# Altium schematic sheet SOCPSBanks.SchDoc
size A3; SheetNumber: 14; SheetTotal: 18
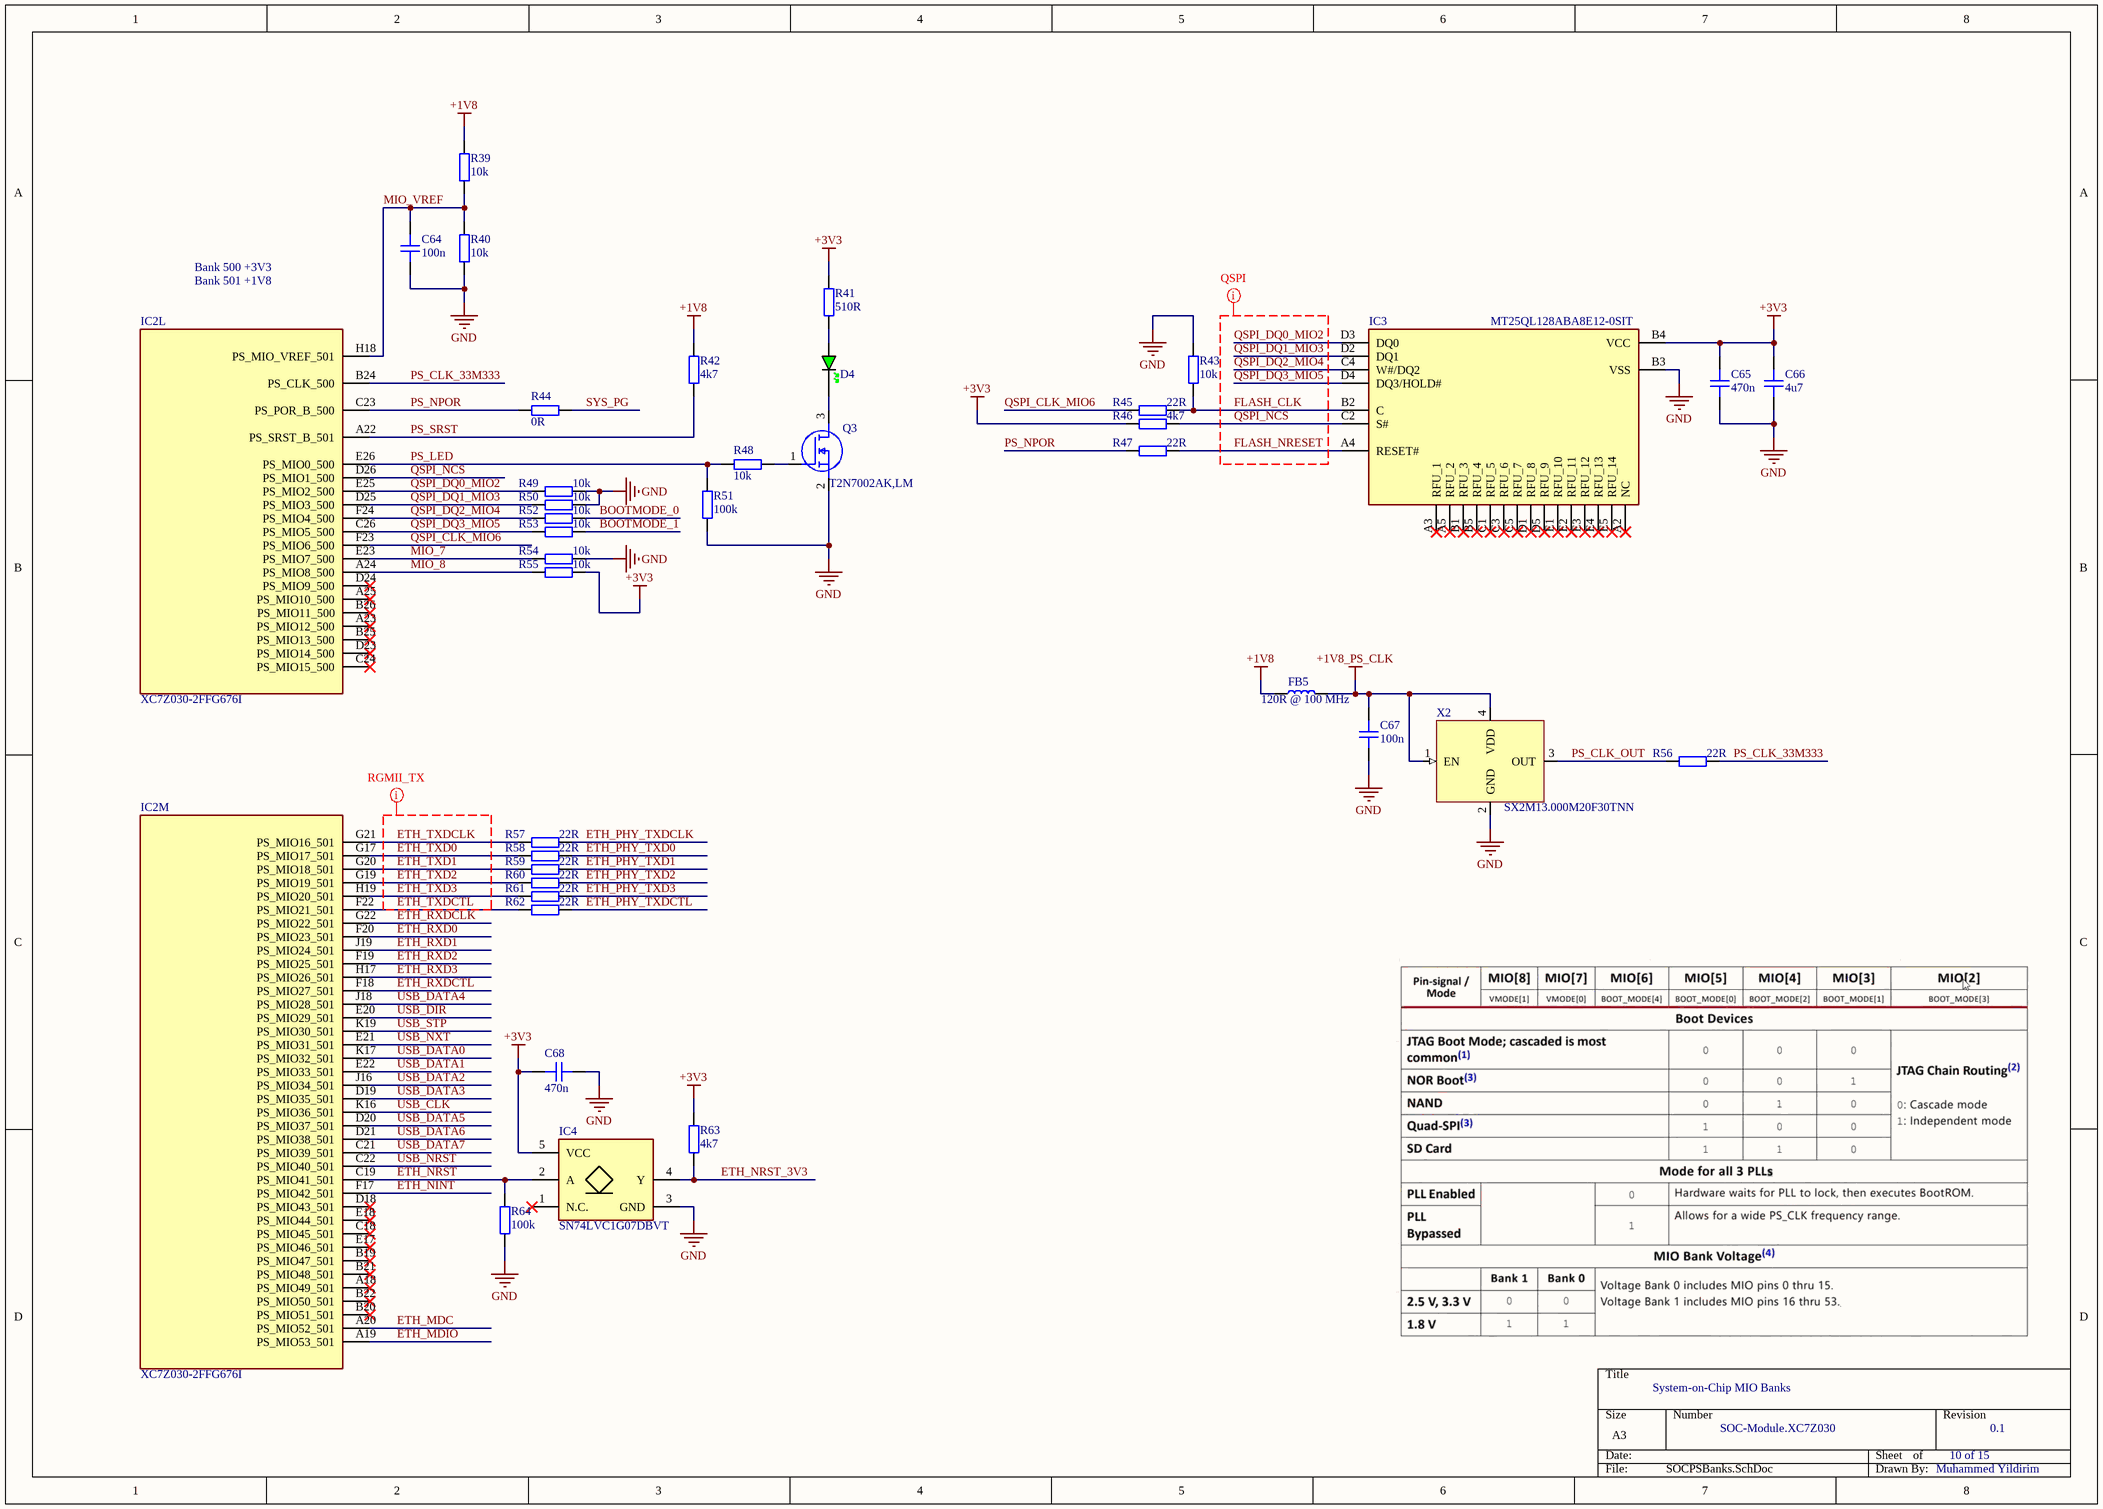
[diagram p0: SOCPSBanks.SchDoc]

## Parts
C64  100n  [CAP_0201]
C65  470n  [CAP_0201]
C66  4u7  [CAP_0402]
C67  100n  [CAP_0201]
C68  470n  [CAP_0201]
D4  GREEN  [LED_0603_GREEN]  (value not drawn)
FB5  120R @ 100 MHz  [IND_0201]
IC2  XC7Z030-2FFG676I  [BGA676C100P26X26_2700X2700X324]  (parts L,M of 15)
IC3  MT25QL128ABA8E12-0SIT  [BGA24C100P5X5_600X800X120]
IC4  SN74LVC1G07DBVT  [SOT95P280X145-5N]
Q3  T2N7002AK,LM  [TBAT54CLM]
R39  10k  [RES_0201]
R40  10k  [RES_0201]
R41  510R  [RES_0603]
R42  4k7  [RES_0201]
R43  10k  [RES_0201]
R44  0R  [RES_0402]
R45  22R  [RES_0201]
R46  4k7  [RES_0201]
R47  22R  [RES_0201]
R48  10k  [RES_0201]
R49  10k  [RES_0201]
R50  10k  [RES_0201]
R51  100k  [RES_0201]
R52  10k  [RES_0201]
R53  10k  [RES_0201]
R54  10k  [RES_0201]
R55  10k  [RES_0201]
R56  22R  [RES_0201]
R57  22R  [RES_0201]
R58  22R  [RES_0201]
R59  22R  [RES_0201]
R60  22R  [RES_0201]
R61  22R  [RES_0201]
R62  22R  [RES_0201]
R63  4k7  [RES_0201]
R64  100k  [RES_0201]
X2  SX2M13.000M20F30TNN  [XTAL_2520]

## Nets
+1V8: FB5.1 R39.1 R42.2
+1V8_PS_CLK: C67.1 FB5.2 X2.1(EN) X2.4(VDD)
+3V3: C65.2 C66.2 C68.2 IC3.B4(VCC) IC4.5(VCC) R41.2 R46.2 R55.1 R63.2
GND: C64.2 C65.1 C66.1 C67.2 C68.1 IC3.B3(VSS) IC4.3(GND) Q3.2(S) R40.2 R43.1 R49.1 R50.1 R51.1 R54.1 R64.1 X2.2(GND)
BOOTMODE_0: R52.1
BOOTMODE_1: R53.1
ETH_MDC: IC2.A20(PS_MIO52_501)
ETH_MDIO: IC2.A19(PS_MIO53_501)
ETH_NINT: IC2.F17(PS_MIO42_501)
ETH_NRST: IC2.C19(PS_MIO41_501) IC4.2(A) R64.2
ETH_NRST_3V3: IC4.4(Y) R63.1
ETH_PHY_TXD0: R58.1
ETH_PHY_TXD1: R59.1
ETH_PHY_TXD2: R60.1
ETH_PHY_TXD3: R61.1
ETH_PHY_TXDCLK: R57.1
ETH_PHY_TXDCTL: R62.1
ETH_RXD0: IC2.F20(PS_MIO23_501)
ETH_RXD1: IC2.J19(PS_MIO24_501)
ETH_RXD2: IC2.F19(PS_MIO25_501)
ETH_RXD3: IC2.H17(PS_MIO26_501)
ETH_RXDCLK: IC2.G22(PS_MIO22_501)
ETH_RXDCTL: IC2.F18(PS_MIO27_501)
ETH_TXD0: IC2.G17(PS_MIO17_501) R58.2
ETH_TXD1: IC2.G20(PS_MIO18_501) R59.2
ETH_TXD2: IC2.G19(PS_MIO19_501) R60.2
ETH_TXD3: IC2.H19(PS_MIO20_501) R61.2
ETH_TXDCLK: IC2.G21(PS_MIO16_501) R57.2
ETH_TXDCTL: IC2.F22(PS_MIO21_501) R62.2
FLASH_CLK: IC3.B2(C) R43.2 R45.1
FLASH_NRESET: IC3.A4(RESET#) R47.1
MIO_7: IC2.E23(PS_MIO7_500) R54.2
MIO_8: IC2.A24(PS_MIO8_500) R55.2
MIO_VREF: C64.1 IC2.H18(PS_MIO_VREF_501) R39.2 R40.1
PS_CLK_33M333: IC2.B24(PS_CLK_500) R56.2
PS_CLK_OUT: R56.1 X2.3(OUT)
PS_LED: IC2.E26(PS_MIO0_500) R48.2 R51.2
PS_NPOR: IC2.C23(PS_POR_B_500) R44.2 R47.2
PS_SRST: IC2.A22(PS_SRST_B_501) R42.1
QSPI_CLK_MIO6: IC2.F23(PS_MIO6_500) R45.2
QSPI_DQ0_MIO2: IC2.E25(PS_MIO2_500) IC3.D3(DQ0) R49.2
QSPI_DQ1_MIO3: IC2.D25(PS_MIO3_500) IC3.D2(DQ1) R50.2
QSPI_DQ2_MIO4: IC2.F24(PS_MIO4_500) IC3.C4(W#/DQ2) R52.2
QSPI_DQ3_MIO5: IC2.C26(PS_MIO5_500) IC3.D4(DQ3/HOLD#) R53.2
QSPI_NCS: IC2.D26(PS_MIO1_500) IC3.C2(S#) R46.1
SYS_PG: R44.1
USB_CLK: IC2.K16(PS_MIO36_501)
USB_DATA0: IC2.K17(PS_MIO32_501)
USB_DATA1: IC2.E22(PS_MIO33_501)
USB_DATA2: IC2.J16(PS_MIO34_501)
USB_DATA3: IC2.D19(PS_MIO35_501)
USB_DATA4: IC2.J18(PS_MIO28_501)
USB_DATA5: IC2.D20(PS_MIO37_501)
USB_DATA6: IC2.D21(PS_MIO38_501)
USB_DATA7: IC2.C21(PS_MIO39_501)
USB_DIR: IC2.E20(PS_MIO29_501)
USB_NRST: IC2.C22(PS_MIO40_501)
USB_NXT: IC2.E21(PS_MIO31_501)
USB_STP: IC2.K19(PS_MIO30_501)
NetD4_A: D4.A R41.1
NetD4_K: D4.K Q3.3(D)
NetQ3_1: Q3.1(G) R48.1

Not connected (* = marked no-connect by the designer): IC2 A18(PS_MIO49_501)* A23(PS_MIO12_500)* A25(PS_MIO10_500)* B19(PS_MIO47_501)* B20(PS_MIO51_501)* B21(PS_MIO48_501)* B22(PS_MIO50_501)* B25(PS_MIO13_500)* B26(PS_MIO11_500)* C18(PS_MIO45_501)* C24(PS_MIO15_500)* D18(PS_MIO43_501)* D23(PS_MIO14_500)* D24(PS_MIO9_500)* E17(PS_MIO46_501)* E18(PS_MIO44_501)*; IC3 A2(NC)* A3(RFU_1)* A5(RFU_2)* B1(RFU_3)* B5(RFU_4)* C1(RFU_5)* C3(RFU_6)* C5(RFU_7)* D1(RFU_8)* D5(RFU_9)* E1(RFU_10)* E2(RFU_11)* E3(RFU_12)* E4(RFU_13)* E5(RFU_14)*; IC4 1(N.C.)*

## Layout directives
mark named QSPI: FLASH_CLK, FLASH_NRESET, QSPI_DQ0_MIO2, QSPI_DQ1_MIO3, QSPI_DQ2_MIO4, QSPI_DQ3_MIO5, QSPI_NCS
mark named RGMII_TX: ETH_TXD0, ETH_TXD1, ETH_TXD2, ETH_TXD3, ETH_TXDCLK, ETH_TXDCTL

## Notes on the sheet
- Bank 500 +3V3
- Bank 501 +1V8
- System-on-Chip MIO Banks
- SOC-Module.XC7Z030
- 10 of 15
- 0.1
- Muhammed Yildirim

## Library data of the parts
C64 C65 C67 C68 = CAP_0201: Capacitor SMD 0201; Manufacturer: *; Manufacturer Part Number: *; Distributor Link: *; LCSC: *; Rating: *; Dielectric: *
C66 = CAP_0402: Capacitor SMD 0402; Manufacturer: *; Manufacturer Part Number: *; Distributor Link: *; LCSC: *; Rating: *; Dielectric: *
D4 = LED_0603_GREEN: LED 0603 GREEN SMD
FB5 = IND_0201: Inductor SMD 0201; Manufacturer_Name: Murata Electronics; Manufacturer_Part_Number: LQP03HQ56NH02D; Datasheet Link: https://psearch.en.murata.com/inductor/product/LQP03HQ56NH02%23.html; Height: 0.42mm; Mouser Part Number: 81-LQP03HQ56NH02D; Mouser Price/Stock: https://www.mouser.co.uk/ProductDetail/Murata-Electronics/LQP03HQ56NH02D?qs=B6kkDfuK7%2FBQu1Ob9%2FT2Bg%3D%3D
IC2 = XC7Z030-2FFG676I: Integrated Circuit; Manufacturer_Name: AMD; Datasheet Link: http://www.xilinx.com/support/documentation/data_sheets/ds190-Zynq-7000-Overview.pdf; Height: 3.24mm; Manufacturer_Part_Number: XC7Z030-2FFG676I; Mouser Part Number: 217-XC7Z030-2FFG676I; Mouser Price/Stock: https://www.mouser.co.uk/ProductDetail/Xilinx/XC7Z030-2FFG676I?qs=rrS6PyfT74cuZK5O3CSpmw%3D%3D
IC3 = MT25QL128ABA8E12-0SIT: Micron 128 Mb QSPI NOR-Flash; Datasheet Link: https://media-www.micron.com/-/media/client/global/documents/products/data-sheet/nor-flash/serial-nor/mt25q/die-rev-a/mt25q_qlhs_l_128_aba_0.pdf?rev=8abb836059694966b54cf068a1803757; Height: 1.2mm; Manufacturer_Name: Micron; Manufacturer_Part_Number: MT25QL128ABA8E12-0SIT; Mouser Part Number: 340-283174-TRAY; Mouser Price/Stock: https://www.mouser.co.uk/ProductDetail/Micron/MT25QL128ABA8E12-0SIT?qs=rrS6PyfT74dfqAxiSUhsIQ%3D%3D; Arrow Part Number: MT25QL128ABA8E12-0SIT; Arrow Price/Stock: https://www.arrow.com/en/products/mt25ql128aba8e12-0sit/micron-technology?region=nac
IC4 = SN74LVC1G07DBVT: Integrated Circuit; Manufacturer_Name: Texas Instruments; Datasheet Link: http://www.ti.com/lit/gpn/sn74lvc1g07; Height: 1.45mm; Manufacturer_Part_Number: SN74LVC1G07DBVT; Mouser Part Number: 595-SN74LVC1G07DBVT; Mouser Price/Stock: https://www.mouser.co.uk/ProductDetail/Texas-Instruments/SN74LVC1G07DBVT?qs=pajgIaoyDUjU1UIYfW1NgQ%3D%3D; Arrow Part Number: SN74LVC1G07DBVT; Arrow Price/Stock: https://www.arrow.com/en/products/sn74lvc1g07dbvt/texas-instruments?region=nac
Q3 = T2N7002AK,LM: MOSFET (N-Channel); Manufacturer_Name: Toshiba; Datasheet Link: http://toshiba.semicon-storage.com/info/docget.jsp?did=29712&prodName=T2N7002AK; Height: 1.1mm; Manufacturer_Part_Number: T2N7002AK,LM; Mouser Part Number: 757-T2N7002AKLM; Mouser Price/Stock: https://www.mouser.co.uk/ProductDetail/Toshiba/T2N7002AKLM?qs=pzVvXTvk9PzfX4hYglwZ9Q%3D%3D; Arrow Part Number: T2N7002AK,LM; Arrow Price/Stock: https://www.arrow.com/en/products/t2n7002aklm/toshiba?region=nac
R39 R40 R42 R43 R45-R64 = RES_0201: Resistor SMD 0201; Manufacturer: *; Manufacturer Part Number: *; Distributor Link: *; LCSC: *
R41 = RES_0603: Resistor SMD 0603; Manufacturer: *; Manufacturer Part Number: *; Distributor Link: *; LCSC: *
R44 = RES_0402: Resistor SMD 0402; Manufacturer: *; Manufacturer Part Number: *; Distributor Link: *; LCSC: *
X2 = ECS-2520MV-130-BN-TR: Standard Clock Oscillators XO (Standard),13MHz,Standby (Power Down),CMOS, Multi-Volt,1.6 V 3.6 V,+/-50ppm,-40 C 85 C,6mA,Surface Mount,4-SMD, No Lead,(2.50mm x 2.00mm),(0.80mm); Manufacturer: ECS; Manufacturer Part Number: ECS-2520MV-130-BN-TR